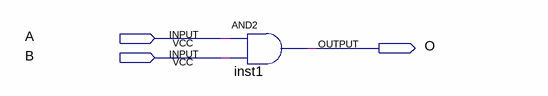
[diagram p0: schematic sheet]
// Quartus schematic KTS.bdf as structural Verilog: 1 symbols, 3 pins
module KTS (
  input  A,
  input  B,
  output O
);

  and inst1 (O, A, B);
endmodule
